# Altium schematic sheet TOP.SchDoc
size A4; DocumentNumber: 1; SheetNumber: 1; SheetTotal: 4
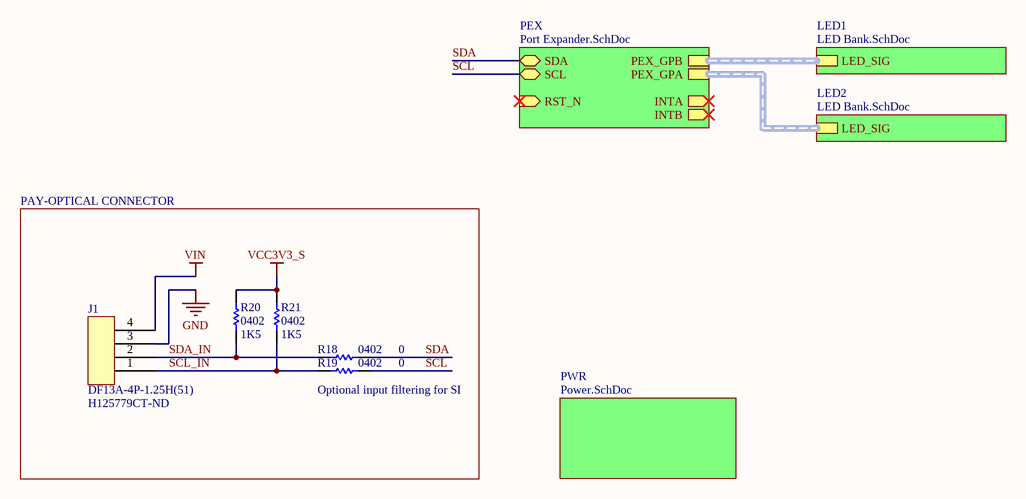
[diagram p0: TOP.SchDoc]

## Parts
J1  DF13A-4P-1.25H(51)  Supplier Part Number 1: H125779CT-ND  [DF13A-4P-1.25H(51)]
R18  0402  value 0  [RES0402R]
R19  0402  value 0  [RES0402R]
R20  0402  value 1K5  [RES0402R]
R21  0402  value 1K5  [RES0402R]

## Sub-sheets
LED1 = LED Bank.SchDoc: LED_SIG (harness LED_SIG)
LED2 = LED Bank.SchDoc: LED_SIG (harness LED_SIG)
PEX = Port Expander.SchDoc: PEX_GPB (harness PEX_GPB), INTB (out), PEX_GPA (harness PEX_GPA), RST_N (in), INTA (out), SCL (bidir), SDA (bidir)
PWR = Power.SchDoc: no entries

## Nets
GND: J1.3
VCC3V3_S: R20.2 R21.2
VIN: J1.4
SCL: R19.2 ; sheet PEX/SCL
SCL_IN: J1.1 R19.1 R21.1
SDA: R18.2 ; sheet PEX/SDA
SDA_IN: J1.2 R18.1 R20.1

## Buses and harness runs
harness sheet LED1/LED_SIG = sheet PEX/PEX_GPB
harness sheet LED2/LED_SIG = sheet PEX/PEX_GPA

## Notes on the sheet
- PAY-OPTICAL CONNECTOR
- (near R19) Optional input filtering for SI

## Library data of the parts
J1 = DF13A-4P-1.25H(51): 4 pos DF13 right angle surface mount connector; Supplier 1: Digi-Key
R18 R19 = RES0402: 0402 resistor; Manufacturer: Panasonic; Manufacturer Part Number: ERJ-2GE0R00X; Resistance: 0mR; Power Rating: 100mW; Voltage Rating: 50V; Tolerance: 5%; Temperature Coefficient: 600ppm/°C; Supplier 1: Digi-Key; Supplier Part Number 1: P0.0JCT-ND; Stock 1: 47740000; Pricing 1: 1=0.1, 10=0.03, 25=0.0216, 50=0.0164, 100=0.0121, 250=0.00924, 500=0.0074, 1000=0.00545, 5000=0.00391 (USD); Mount: Surface Mount; Case/Package: 0402; Case Code (Metric): 1005; Case Code (Imperial): 0402; Contact Plating: Tin; Min Operating Temperature: -55°C; Max Operating Temperature: 155°C; Packaging: Tape and Reel; Package Quantity: 1; Composition: Thick Film; Number of Terminations: 2; Termination: SMD/SMT; Military Standard: Not; Max Power Dissipation: 100mW; Voltage Rating (DC): 50V; Features: Automotive AEC-Q200; Length: 1mm; Height: 0.35mm; Width: 0.02inch; Depth: 0.5mm; Radiation Hardening: No; REACH SVHC: No SVHC; Lead Free: Lead Free; ComponentLink1URL: http://industrial.panasonic.com/www-data/pdf/AOA0000/AOA0000CE1.pdf?src-supplier=Avnet; ComponentLink1Description: http://industrial.panasonic.com/www-data/pdf/AOA0000/AOA0000CE1.pdf?src-supplier=Avnet; ComponentLink2URL: http://www.alliedelec.com/m/d/51cd0790071e1666bdb9d00c57fcf960.pdf?src-supplier=Allied+Electronics; ComponentLink2Description: http://www.alliedelec.com/m/d/51cd0790071e1666bdb9d00c57fcf960.pdf?src-supplier=Allied+Electronics; ComponentLink3URL: http://industrial.panasonic.com/www-data/pdf/AOA0000/AOA0000CE1.pdf?src-supplier=Avnet+Europe; ComponentLink3Description: http://industrial.panasonic.com/www-data/pdf/AOA0000/AOA0000CE1.pdf?src-supplier=Avnet+Europe; ComponentLink4URL: http://www.farnell.com/datasheets/2059623.pdf?src-supplier=Farnell; ComponentLink4Description: http://www.farnell.com/datasheets/2059623.pdf?src-supplier=Farnell; ComponentLink5URL: http://www.farnell.com/datasheets/2059623.pdf?src-supplier=Element14; ComponentLink5Description: http://www.farnell.com/datasheets/2059623.pdf?src-supplier=Element14; ComponentLink6URL: http://www.farnell.com/datasheets/1678796.pdf?src-supplier=Element14; ComponentLink6Description: http://www.farnell.com/datasheets/1678796.pdf?src-supplier=Element14
R20 R21 = RES0402: 0402 resistor